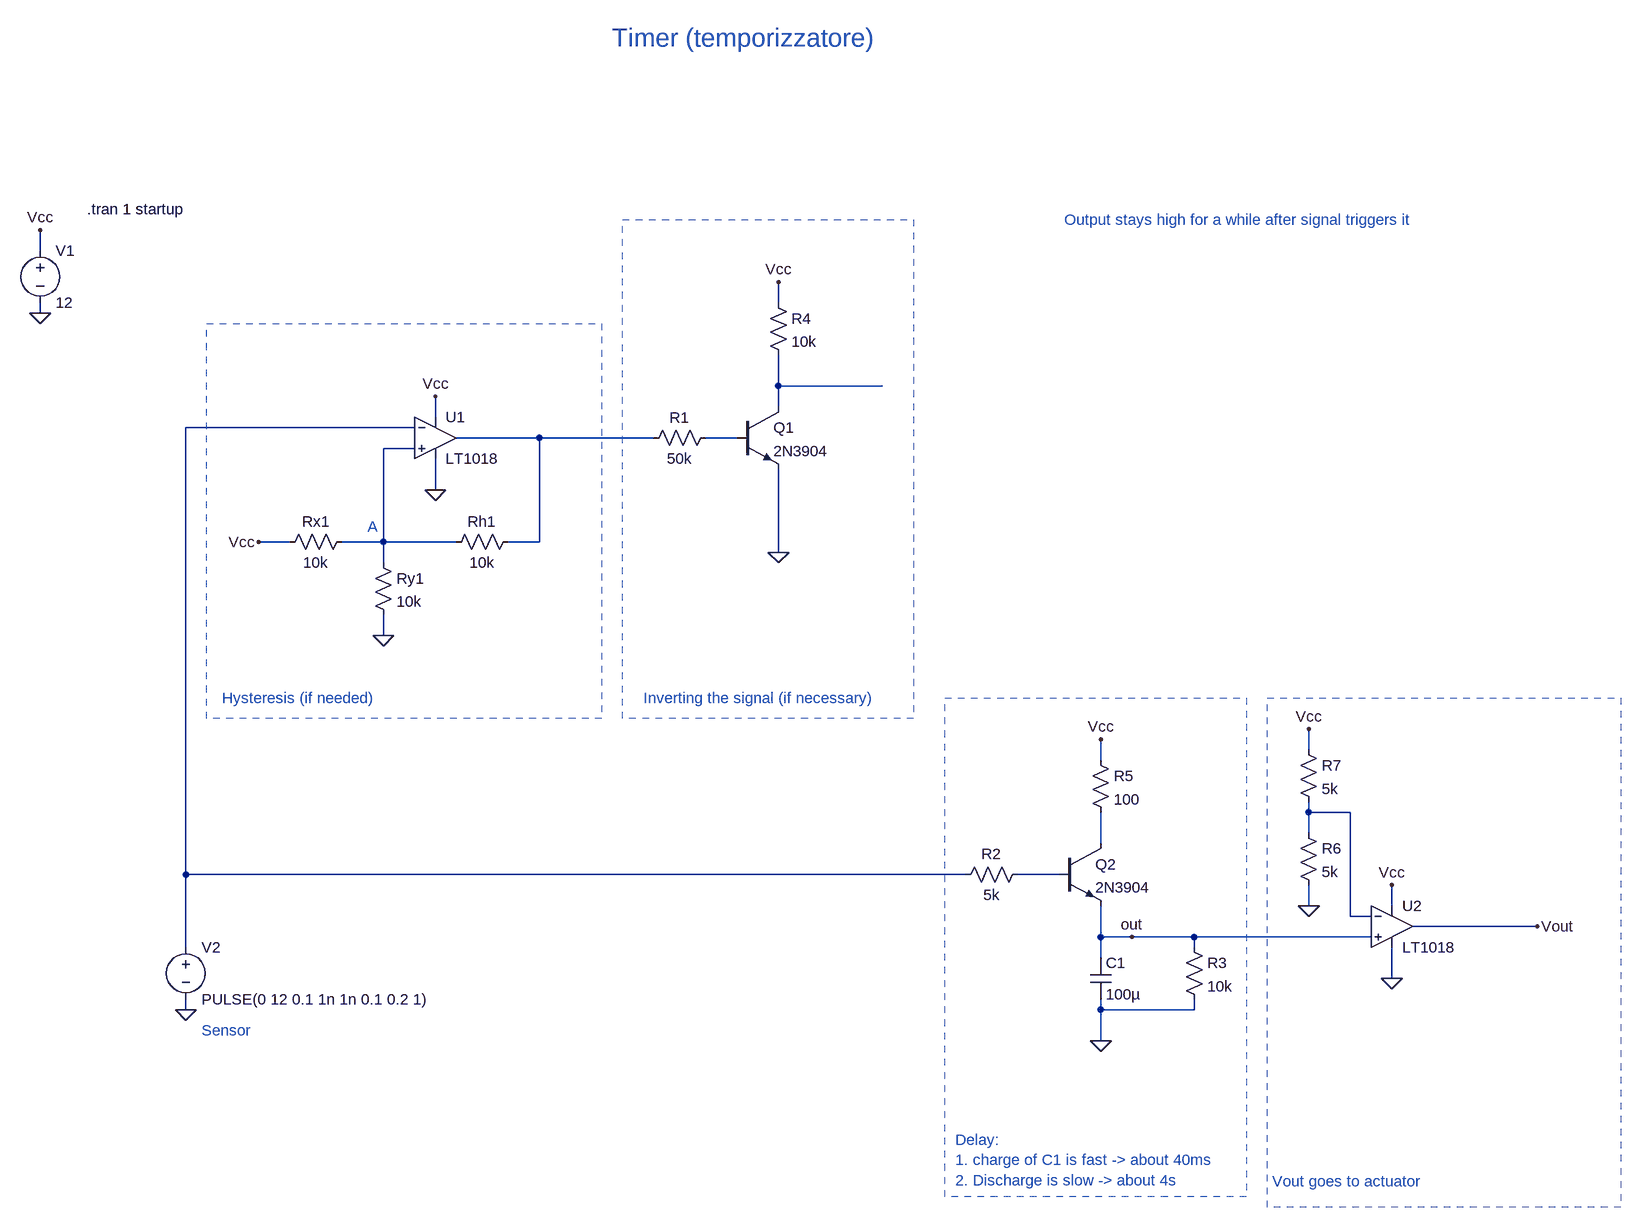
[diagram p0: schematic Sensor-triggered-timer-temporizzatore-2.asc]
Sensor-triggered-timer-temporizzatore-2.asc, the LTspice schematic file:
Version 4
SHEET 1 1716 680
WIRE -720 -880 -720 -912
WIRE 416 -800 416 -832
WIRE -720 -784 -720 -800
WIRE 416 -672 416 -720
WIRE 576 -672 416 -672
WIRE 416 -640 416 -672
WIRE -112 -624 -112 -656
WIRE -144 -608 -496 -608
WIRE 48 -592 -80 -592
WIRE 224 -592 48 -592
WIRE 352 -592 304 -592
WIRE -144 -576 -192 -576
WIRE -112 -512 -112 -560
WIRE -336 -432 -384 -432
WIRE -192 -432 -192 -576
WIRE -192 -432 -256 -432
WIRE -80 -432 -192 -432
WIRE 48 -432 48 -592
WIRE 48 -432 0 -432
WIRE 416 -416 416 -544
WIRE -192 -400 -192 -432
WIRE -192 -288 -192 -320
WIRE 1232 -112 1232 -144
WIRE 912 -96 912 -128
WIRE 1232 -16 1232 -32
WIRE 1296 -16 1232 -16
WIRE 1232 16 1232 -16
WIRE 912 32 912 -16
WIRE -496 80 -496 -608
WIRE 704 80 -496 80
WIRE 848 80 784 80
WIRE 1232 128 1232 96
WIRE 1360 128 1360 96
WIRE 1296 144 1296 -16
WIRE 1328 144 1296 144
WIRE 1584 160 1392 160
WIRE 912 176 912 128
WIRE 960 176 912 176
WIRE 1056 176 960 176
WIRE 1328 176 1056 176
WIRE -496 192 -496 80
WIRE 1056 192 1056 176
WIRE 912 208 912 176
WIRE 1360 240 1360 192
WIRE -496 288 -496 272
WIRE 912 288 912 272
WIRE 1056 288 1056 272
WIRE 1056 288 912 288
WIRE 912 336 912 288
FLAG -720 -784 0
FLAG -720 -912 Vcc
FLAG -112 -656 Vcc
FLAG -192 -288 0
FLAG -384 -432 Vcc
FLAG -112 -512 0
FLAG 912 336 0
FLAG 960 176 out
FLAG -496 288 0
FLAG 416 -416 0
FLAG 416 -832 Vcc
FLAG 912 -128 Vcc
FLAG 1360 96 Vcc
FLAG 1360 240 0
FLAG 1232 -144 Vcc
FLAG 1232 128 0
FLAG 1584 160 Vout
SYMBOL Comparators\\LT1018 -112 -592 R0
SYMATTR InstName U1
SYMBOL voltage -720 -896 R0
WINDOW 123 0 0 Left 0
WINDOW 39 0 0 Left 0
SYMATTR InstName V1
SYMATTR Value 12
SYMBOL res -240 -448 R90
WINDOW 0 0 56 VBottom 2
WINDOW 3 32 56 VTop 2
SYMATTR InstName Rx1
SYMATTR Value 10k
SYMBOL res -208 -416 R0
SYMATTR InstName Ry1
SYMATTR Value 10k
SYMBOL res 16 -448 R90
WINDOW 0 0 56 VBottom 2
WINDOW 3 32 56 VTop 2
SYMATTR InstName Rh1
SYMATTR Value 10k
SYMBOL res 320 -608 R90
WINDOW 0 0 56 VBottom 2
WINDOW 3 32 56 VTop 2
SYMATTR InstName R1
SYMATTR Value 50k
SYMBOL cap 896 208 R0
SYMATTR InstName C1
SYMATTR Value 100µ
SYMBOL res 1040 176 R0
SYMATTR InstName R3
SYMATTR Value 10k
SYMBOL voltage -496 176 R0
WINDOW 123 0 0 Left 0
WINDOW 39 0 0 Left 0
SYMATTR InstName V2
SYMATTR Value PULSE(0 12 0.1 1n 1n 0.1 0.2 1)
SYMBOL npn 352 -640 R0
SYMATTR InstName Q1
SYMATTR Value 2N3904
SYMBOL res 400 -816 R0
SYMATTR InstName R4
SYMATTR Value 10k
SYMBOL res 800 64 R90
WINDOW 0 0 56 VBottom 2
WINDOW 3 32 56 VTop 2
SYMATTR InstName R2
SYMATTR Value 5k
SYMBOL npn 848 32 R0
SYMATTR InstName Q2
SYMATTR Value 2N3904
SYMBOL res 896 -112 R0
SYMATTR InstName R5
SYMATTR Value 100
SYMBOL Comparators\\LT1018 1360 160 R0
SYMATTR InstName U2
SYMBOL res 1216 0 R0
SYMATTR InstName R6
SYMATTR Value 5k
SYMBOL res 1216 -128 R0
SYMATTR InstName R7
SYMATTR Value 5k
TEXT -648 -944 Left 2 !.tran 1 startup
TEXT -216 -456 Left 2 ;A
TEXT -440 -192 Left 2 ;Hysteresis (if needed)
TEXT 208 -192 Left 2 ;Inverting the signal (if necessary)
TEXT 688 488 Left 2 ;Delay:\n1. charge of C1 is fast -> about 40ms\n2. Discharge is slow -> about 4s
TEXT 1176 552 Left 2 ;Vout goes to actuator
TEXT -472 320 Left 2 ;Sensor
TEXT 160 -1208 Left 4 ;Timer (temporizzatore)
TEXT 856 -928 Left 2 ;Output stays high for a while after signal triggers it
RECTANGLE Normal 144 -160 -464 -768 2
RECTANGLE Normal 1136 576 672 -192 2
RECTANGLE Normal 1712 592 1168 -192 2
RECTANGLE Normal 624 -160 176 -928 2

The netlist it stands for:
* Sensor-triggered-timer-temporizzatore-2.asc
XU1 N005 N002 Vcc 0 N003 LT1018  ; pins In+ In- V+ V- OUT
V1 Vcc 0 12
Rx1 N005 Vcc 10k
Ry1 N005 0 10k
Rh1 N003 N005 10k
R1 N004 N003 50k
C1 out 0 100µ
R3 out 0 10k
V2 N002 0 PULSE(0 12 0.1 1n 1n 0.1 0.2 1)
Q1 N001 N004 0 0 2N3904
R4 Vcc N001 10k
R2 N008 N002 5k
Q2 N007 N008 out 0 2N3904
R5 Vcc N007 100
XU2 out N006 Vcc 0 Vout LT1018  ; pins In+ In- V+ V- OUT
R6 N006 0 5k
R7 Vcc N006 5k
.model NPN NPN
.model PNP PNP
.lib standard.bjt
.tran 1 startup
* A
* Hysteresis (if needed)
* Inverting the signal (if necessary)
* Delay:
* 1. charge of C1 is fast -> about 40ms
* 2. Discharge is slow -> about 4s
* Vout goes to actuator
* Sensor
* Timer (temporizzatore)
* Output stays high for a while after signal triggers it
.lib LTC1.lib
.backanno
.end